# EAGLE design RFID_13.55_ant_v1.1 (EAGLE 8.0.1)

## Sheet 1 of 2: RFID_13.55_ant_v1
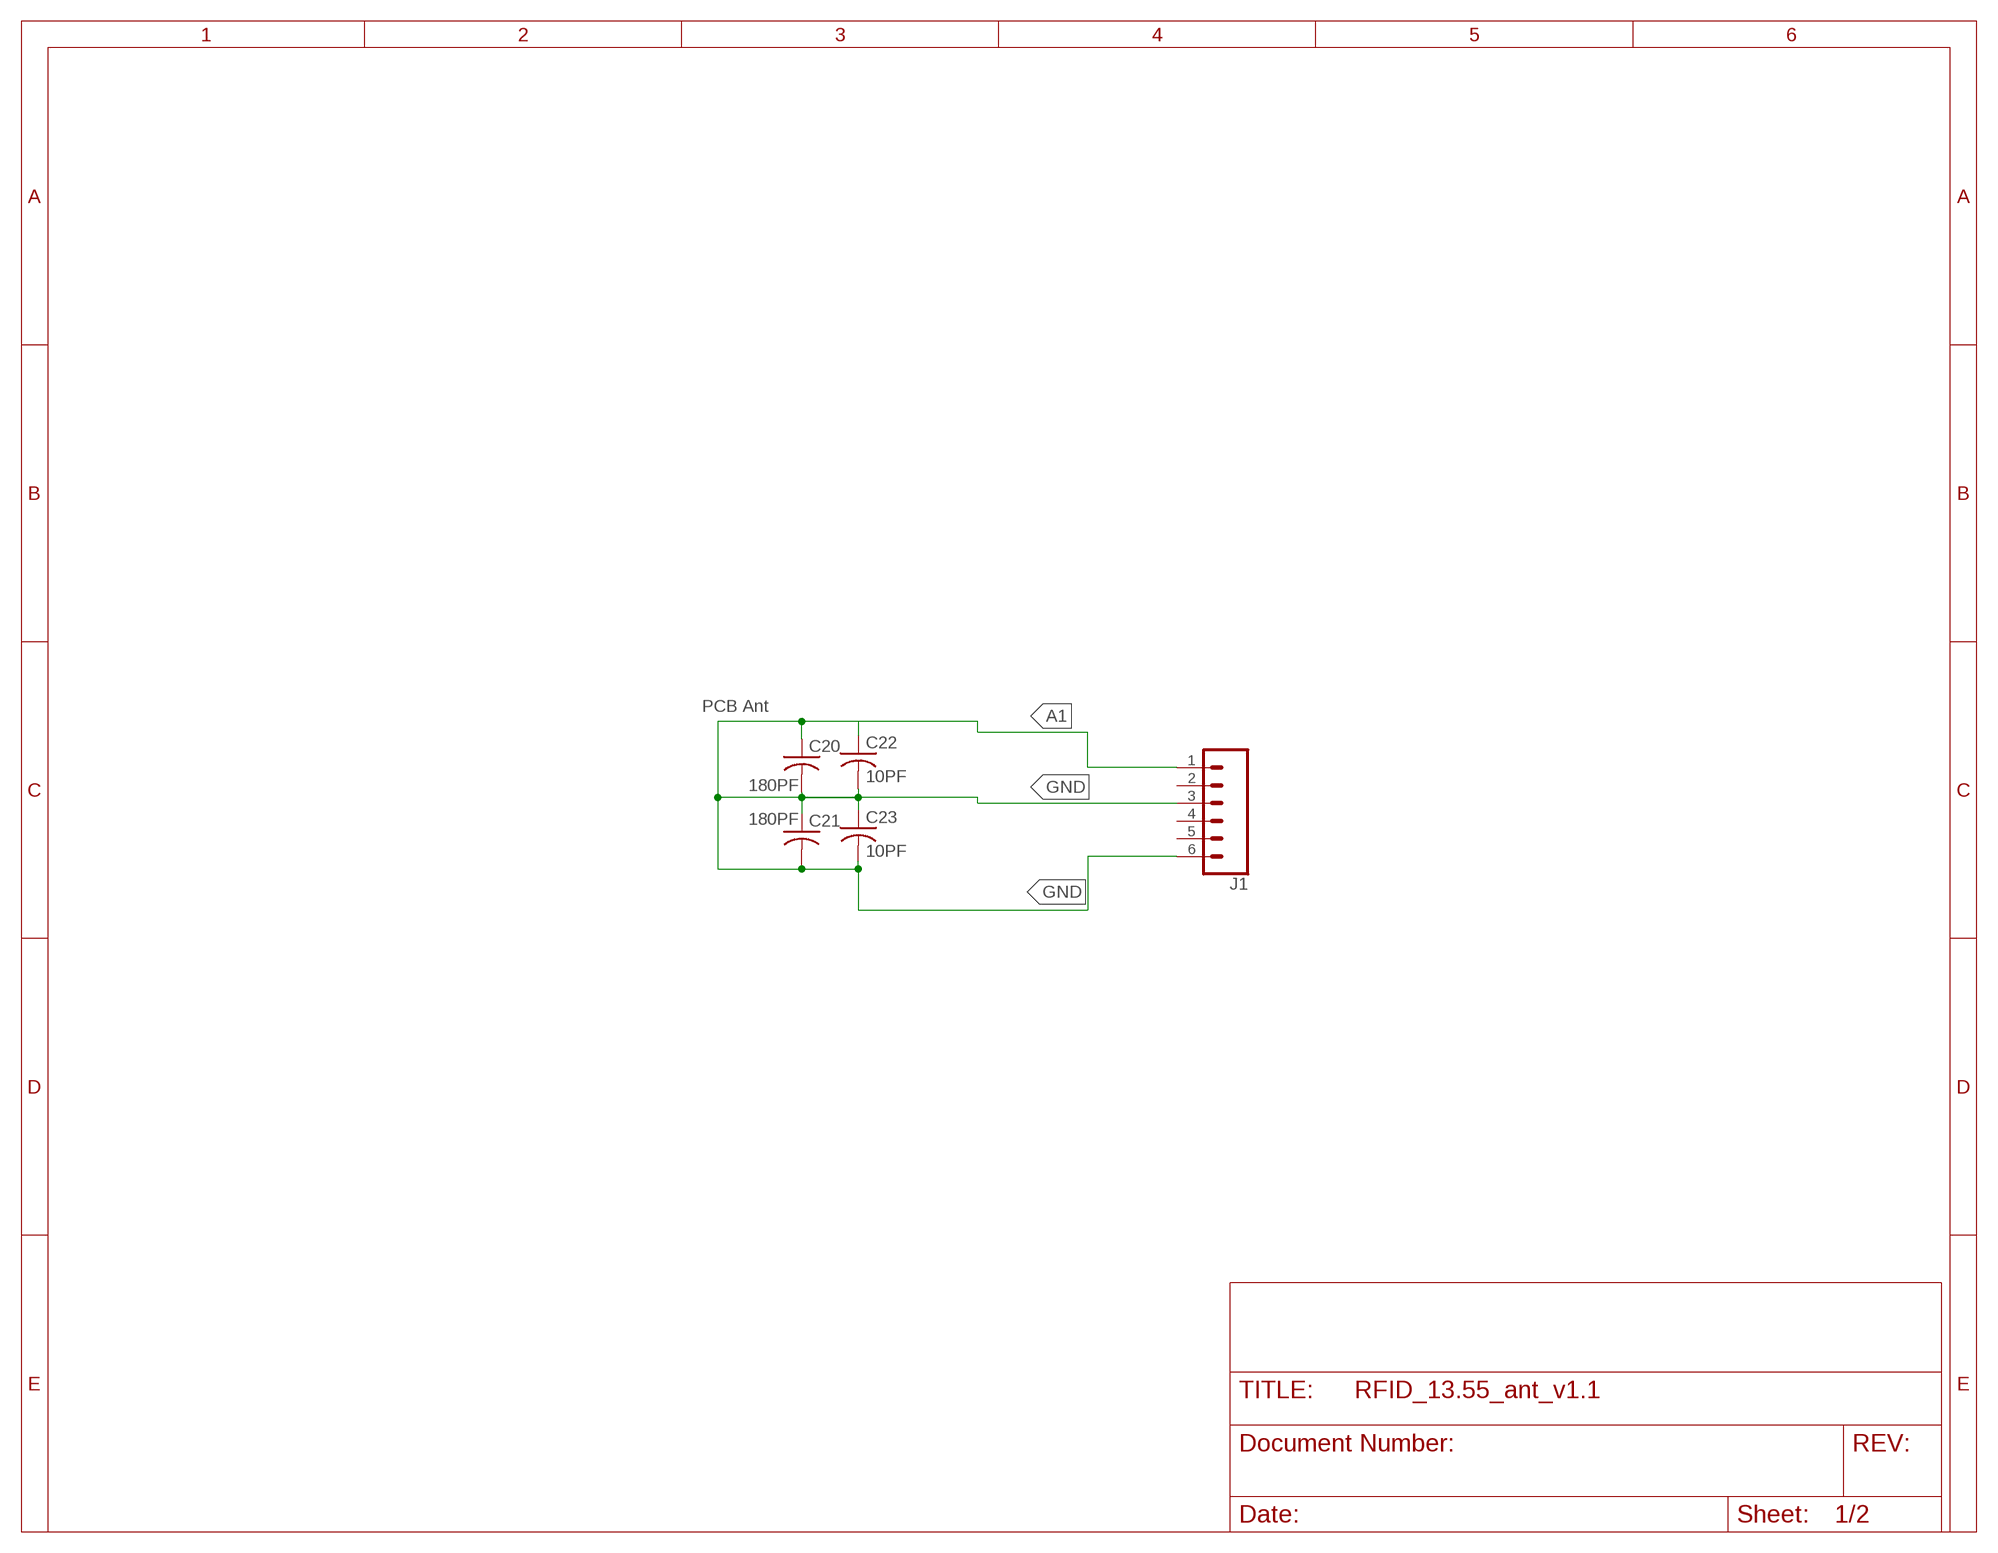
[diagram p0: schematic, sheet 1]

### Parts
C20  180PF  C-USC0603  [C0603]
C21  180PF  C-USC0603  [C0603]
C22  10PF  C-USC0603  [C0603]
C23  10PF  C-USC0603  [C0603]
J1  CONN_06SILK_FEMALE_PTH  [1X06]

### Nets
A1: C20.1 C22.1 J1.1
GND: C20.2 C21.1 C21.2 C22.2 C23.1 C23.2 J1.3 J1.6
Unconnected: J1.2 J1.4 J1.5

### Notes on the sheet
- PCB Ant

## Sheet 2 of 2: Notes
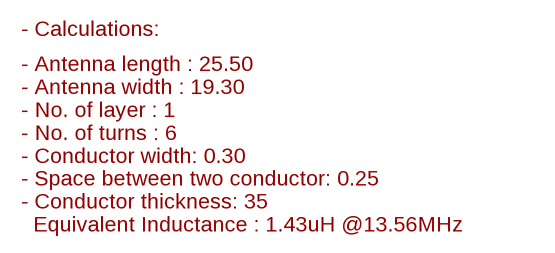
[diagram p1: schematic, sheet 2]

### Notes on the sheet
- - Calculations:
- - Antenna length : 25.50
  - Antenna width : 19.30
  - No. of layer : 1
  - No. of turns : 6
  - Conductor width: 0.30
  - Space between two conductor: 0.25
  - Conductor thickness: 35
    Equivalent Inductance : 1.43uH @13.56MHz

## Library data of the parts
C20-C23 = resistor:C-US: CAPACITOR, American symbol
J1 = SparkFun-Connectors:CONN_06: Multi connection point. Often used as Generic Header-pin footprint for 0.1 inch spaced/style header connections On any of the 0.1 inch spaced packages, you can populate with these: Break Away Headers - Straight <https://www.sparkfun.com/products/116> (PRT-00116) Break Away Male Headers - Right Angle <https://www.sparkfun.com/products/553> (PRT-00553) Female Headers <https://www.sparkfun.com/products/115> (PRT-00115) Break Away Headers - Machine Pin <https://www.sparkfun.com/products/117> (PRT-00117) Break Away Female Headers - Swiss Machine Pin <https://www.sparkfun.com/products/743> (PRT-00743) Arduino Stackable Header - 6 Pin <https://www.sparkfun.com/products/9280> (PRT-09280) For SCREWTERMINALS and SPRING TERMINALS visit here: Screw Terimnals on SparkFun.com <https://www.sparkfun.com/search/results?term=Screw+Terminals> (5mm/3.5mm/2.54mm spacing) This device is also useful as a general connection point to wire up your design to another part of your project. Our various solder wires solder well into these plated through hole pads. Hook-Up Wire - Assortment (Stranded, 22 AWG) <https://www.sparkfun.com/products/11375> (PRT-11375) Hook-Up Wire - Assortment (Solid Core, 22 AWG) <https://www.sparkfun.com/products/11367> (PRT-11367) View the entire wire category on our website here <https://www.sparkfun.com/categories/141>; PROD_ID: CONN-08437

## Board
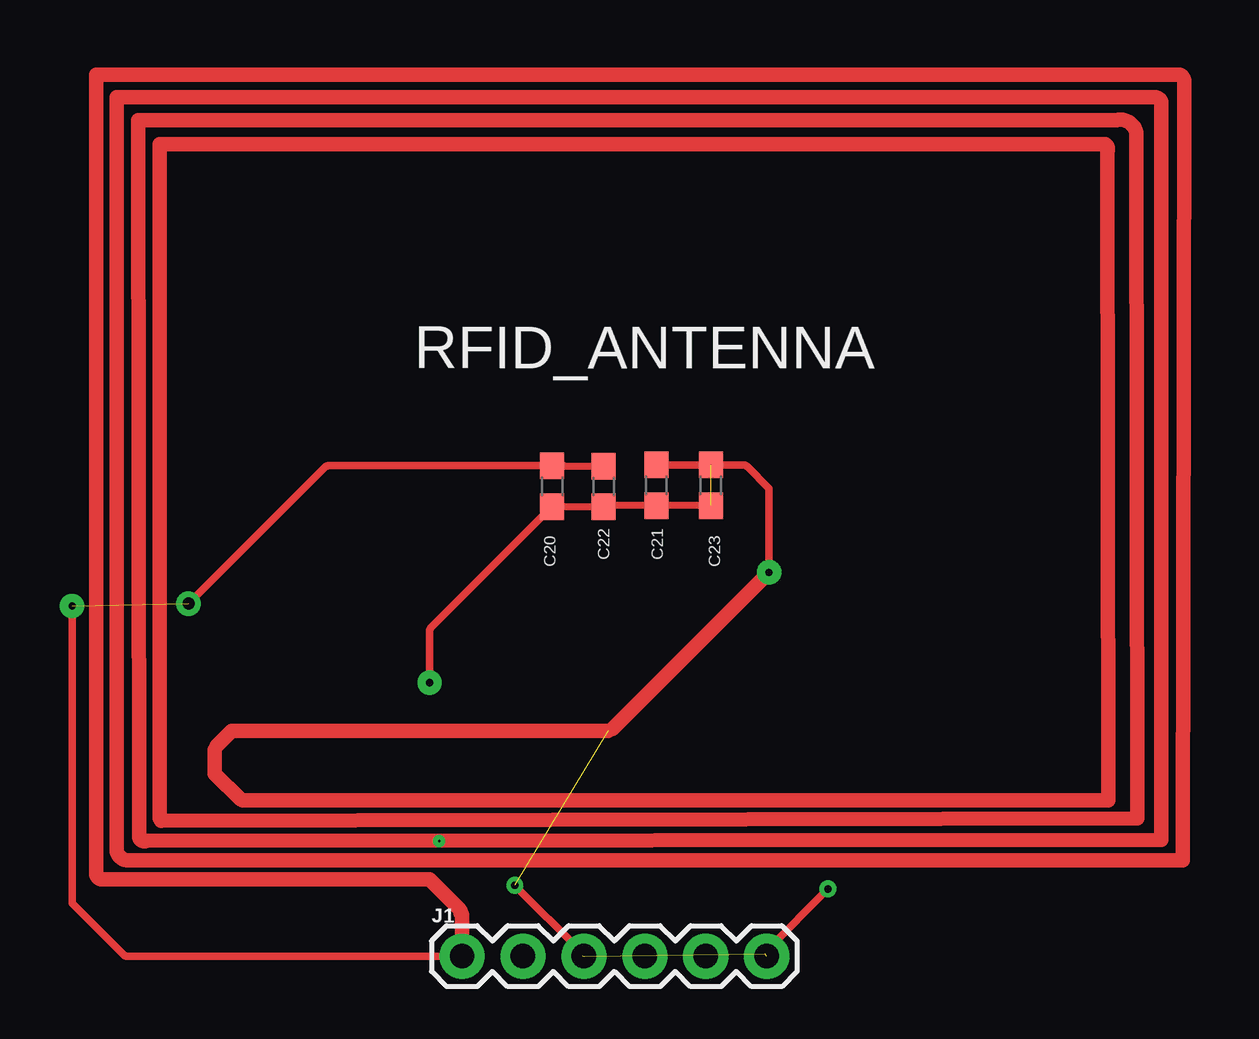
[diagram p2: board, top side]

No outline drawn. Coordinates in mm, seen from the top.
Copper layers (1*16): Top 0.035mm / dielectric 1.5mm / Bottom 0.035mm
Design rules "default": minimum track width 10mil, minimum drill 24mil, track to track 8mil, track to pad 8mil, pad to pad 8mil, via to via 8mil, smd to smd 8mil, copper to edge 40mil, drill to drill 8mil, minimum pad ring 10mil, minimum via ring 8mil, stop-mask expansion 4mil, vias tented up to drill 0mil, thermal gap 10mil

### Footprints (pad centres in the part's own frame; a part is rotated, then mirrored left to right if it is on the bottom)
C0603 = smd 1.1 x 1: 1 -0.85,0; 2 0.85,0
1X06 = drill 1.016 pad 1.88: 1 0,0; 2 2.54,0; 3 5.08,0; 4 7.62,0; 5 10.16,0; 6 12.7,0

### Placement (x,y rotation side)
C20  11.25,14.64 270 top
C21  15.6,14.68 90 top
C22  13.4,14.63 270 top
C23  17.88,14.68 90 top
J1  7.5,-4.95 0 top

### Tracks (layer width: path | path; a pad name or v marks a point on that pad's centre or on a via)
A1  (via drill 0.3 pad 1.02, 0.5 pad 1.02)  (1 unrouted)
  Top 0.3: 13.45,15.53 C22.1 11.75,15.48 C20.1
  Top 0.305: -5.05,0.7 arc-90 -5.1,0.8 | 11.75,15.48 arc45 11.7,15.5 1.96,15.5 arc45 1.78,15.43 v-3.9,9.75 | v-8.75,9.65 -8.75,-2.75 -6.62,-4.88 arc45 -6.45,-4.95 J1.1 | 37.6,31.55 37.6,31.1
  Top 0.61: 37.6,31.55 37.6,31.1 37.55,-0.95 -6.3,-0.95 arc-90 -6.9,-0.55 -6.9,30.85 36.4,30.85 arc-90 36.65,30.6 36.65,-0.1 -5.7,-0.15 arc-90 -5.95,0 -6,29.9 34.8,29.9 arc-90 35.6,29.4 35.65,0.8 -5.05,0.7 | -5.1,0.8 -5.1,28.9 34.3,28.9 arc-90 34.4,28.6 34.45,1.55 -1.65,1.55 | J1.1 7.5,-3.28 arc45 7.45,-3.15 arc45 7.38,-2.98 6.15,-1.75 -7.5,-1.75 arc-90 -7.75,-1.5 -7.75,31.8 37.34,31.8 arc-90 37.6,31.55
GND  (via drill 0.3 pad 0.3, 0.3 pad 1.02)  (5 unrouted)
  Top 0.3: C23.1 C21.1 13.45,13.83 C22.2 C20.2
  Top 0.305: C20.2 6.22,8.76 arc45 6.15,8.59 v6.15,6.45 | C21.2 C23.2 19.21,15.53 arc-45 19.39,15.46 20.3,14.55 v20.3,11.05 | 12.53,-4.93 arc45 12.46,-4.76 v9.7,-2 | 20.15,-4.86 arc-45 20.22,-4.68 v22.75,-2.15 | 13.77,4.52 arc-45 13.6,4.45 | -2.73,3.82 arc45 -2.8,3.65 | -1.74,1.58 arc45 -1.65,1.55
  Top 0.61: v20.3,11.05 13.77,4.52 | -2.73,3.82 -2.1,4.45 13.6,4.45 | -2.8,3.65 -2.8,2.65 -1.74,1.58
N$1  (via drill 0.1)
  other vias: 6.55,-0.15

### Text on the board
tNames: RFID_ANTENNA